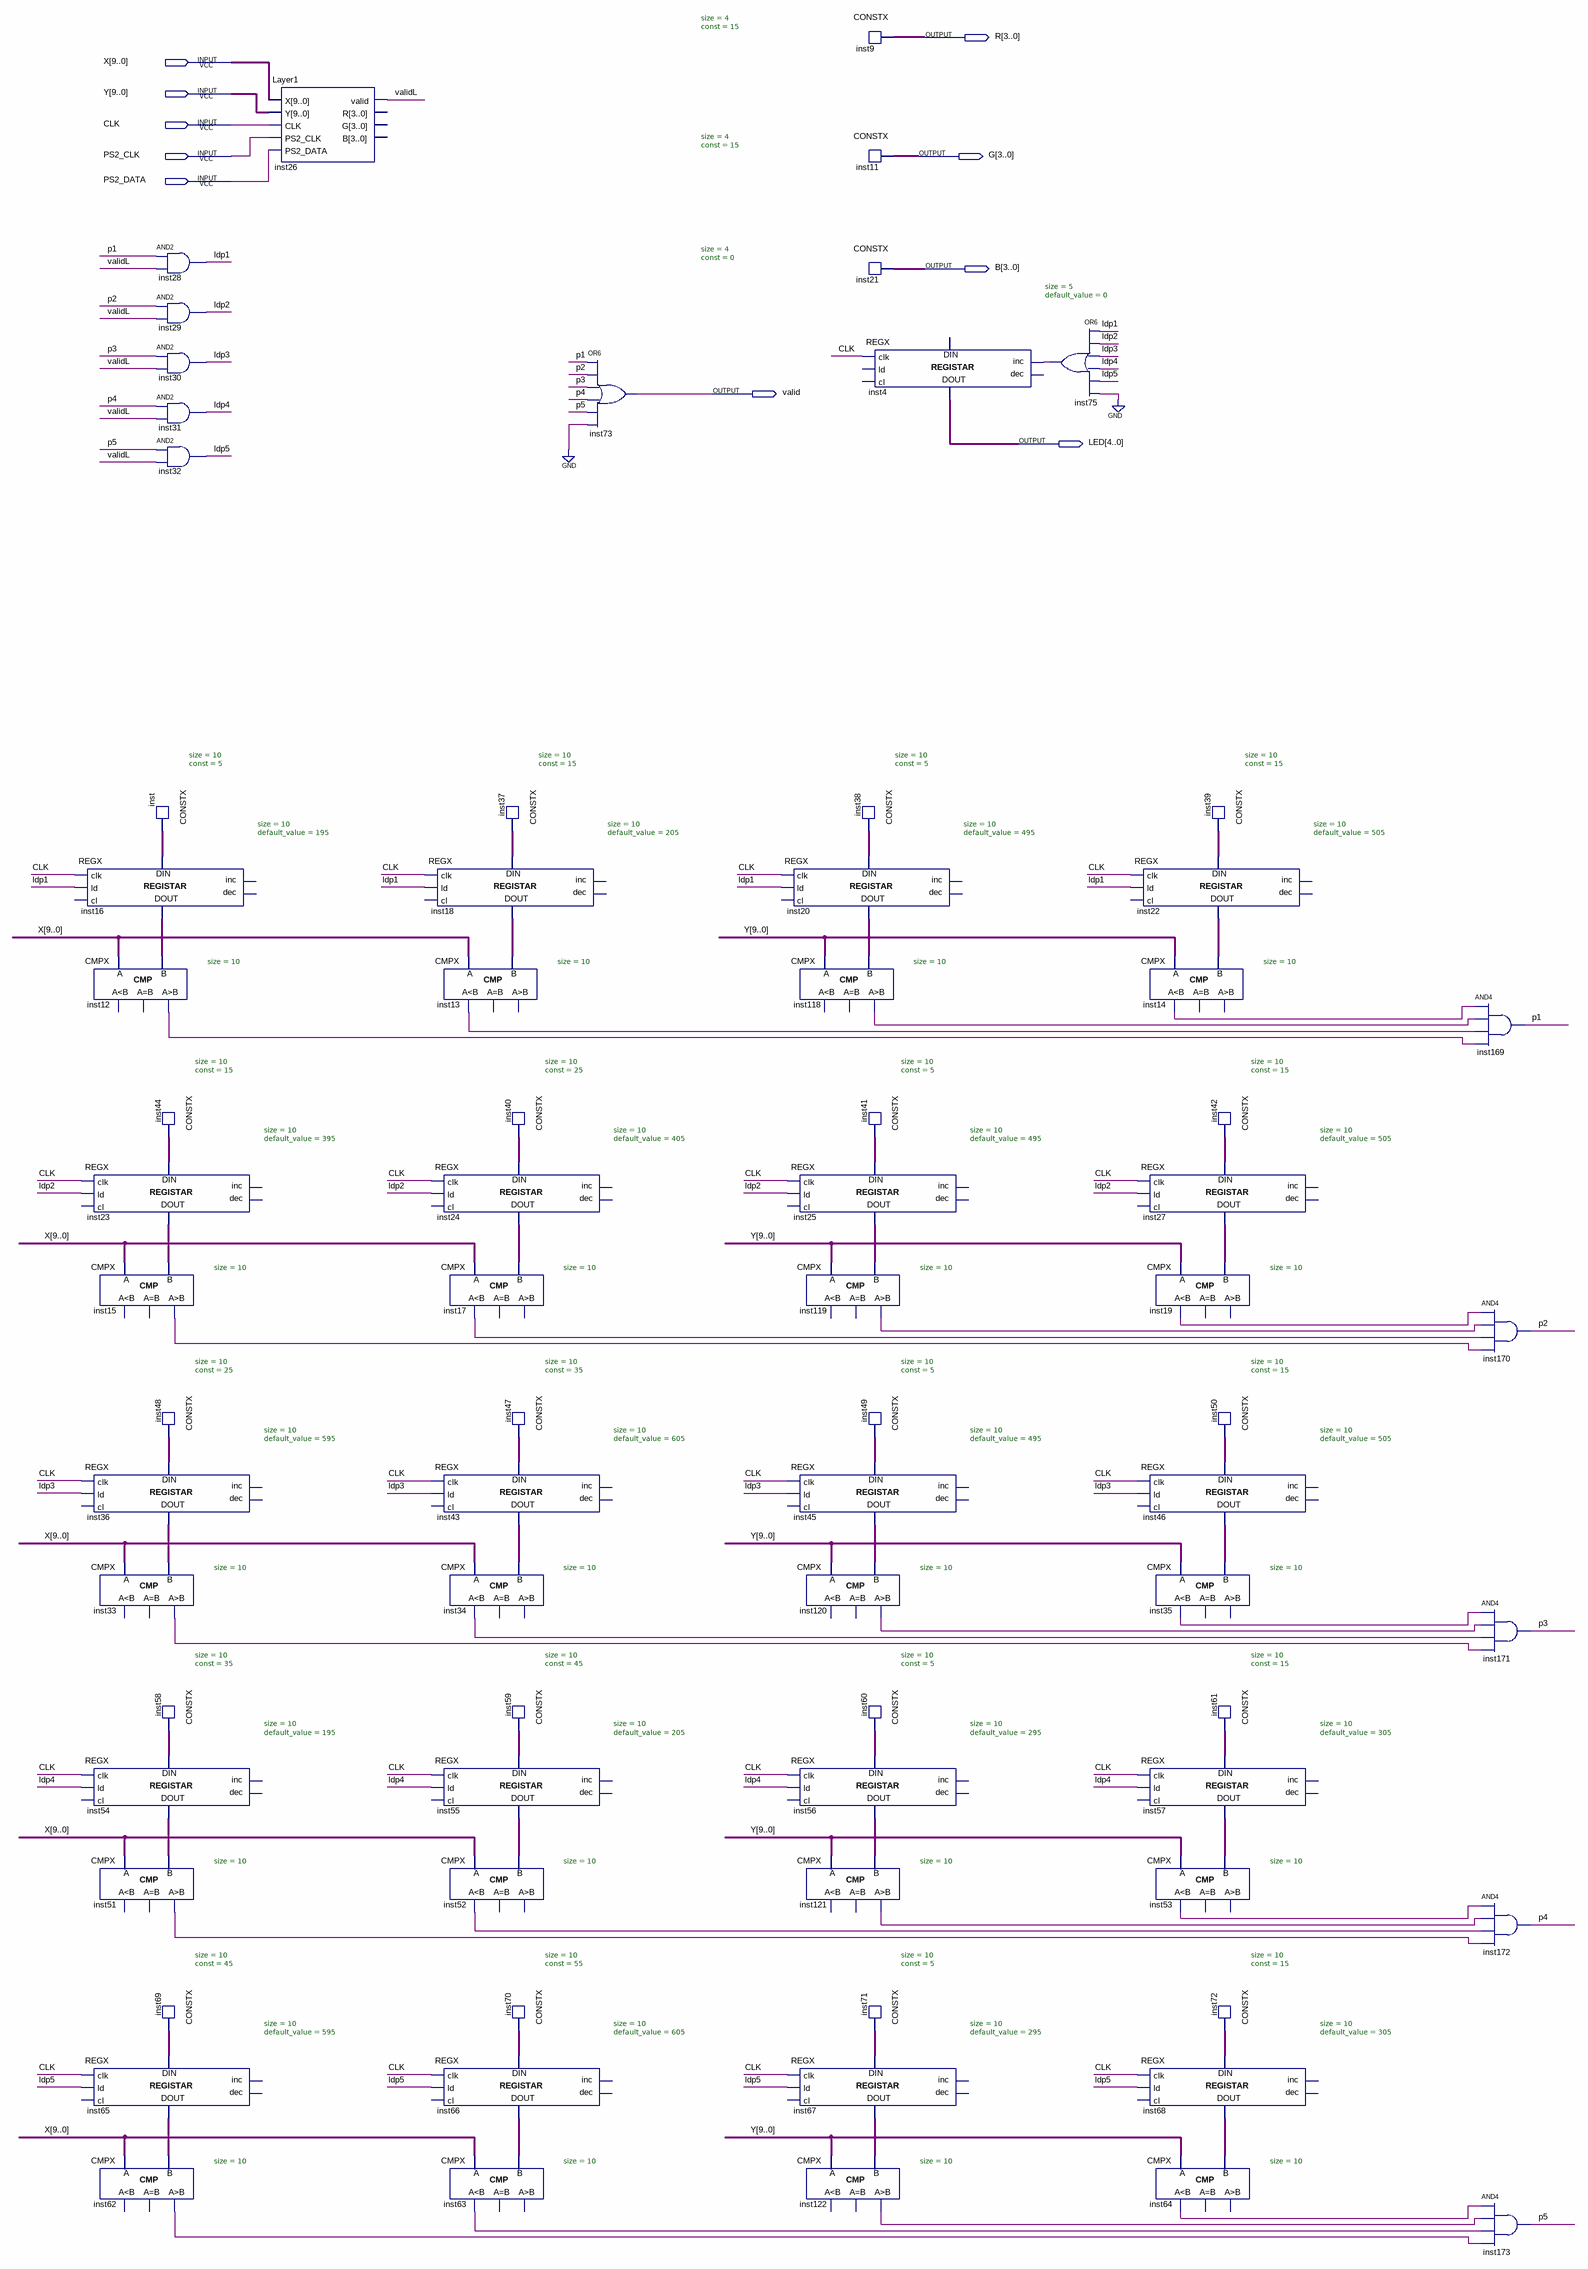
[diagram p0: schematic sheet]
// Quartus schematic Layer2.bdf as structural Verilog: 77 symbols, 10 pins
module Layer2 (
  input  [9:0] X,
  input  [9:0] Y,
  input  CLK,
  input  PS2_CLK,
  input  PS2_DATA,
  output [3:0] R,
  output [3:0] G,
  output [3:0] B,
  output valid,
  output [4:0] LED
);

  wire inst12_gr, inst13_ls, inst14_ls, inst15_gr, inst17_ls, inst19_ls, inst33_gr, inst34_ls, inst35_ls,
       inst51_gr, inst52_ls, inst53_ls, inst62_gr, inst63_ls, inst64_ls, inst75_out, inst118_gr, inst119_gr,
       inst120_gr, inst121_gr, inst122_gr, ldp1, ldp2, ldp3, ldp4, ldp5, p1, p2, p3, p4, p5, validL;
  wire [9:0] inst16_data_out, inst18_data_out, inst20_data_out, inst22_data_out, inst23_data_out,
       inst24_data_out, inst25_data_out, inst27_data_out, inst36_data_out, inst37_data, inst38_data,
       inst39_data, inst40_data, inst41_data, inst42_data, inst43_data_out, inst44_data, inst45_data_out,
       inst46_data_out, inst47_data, inst48_data, inst49_data, inst50_data, inst54_data_out, inst55_data_out,
       inst56_data_out, inst57_data_out, inst58_data, inst59_data, inst60_data, inst61_data, inst65_data_out,
       inst66_data_out, inst67_data_out, inst68_data_out, inst69_data, inst70_data, inst71_data, inst72_data,
       inst_data;

  REGX #(.size(10), .default_value(195)) inst16 (
    .clk(CLK), .ld(ldp1), .data_in(inst_data), .data_out(inst16_data_out));  // open: cl, inc, dec
  CMPX #(.size(10)) inst12 (.A(X), .B(inst16_data_out), .gr(inst12_gr));  // open: ls, eq
  REGX #(.size(10), .default_value(395)) inst23 (
    .clk(CLK), .ld(ldp2), .data_in(inst44_data), .data_out(inst23_data_out));  // open: cl, inc, dec
  REGX #(.size(10), .default_value(595)) inst36 (
    .clk(CLK), .ld(ldp3), .data_in(inst48_data), .data_out(inst36_data_out));  // open: cl, inc, dec
  REGX #(.size(10), .default_value(195)) inst54 (
    .clk(CLK), .ld(ldp4), .data_in(inst58_data), .data_out(inst54_data_out));  // open: cl, inc, dec
  REGX #(.size(10), .default_value(595)) inst65 (
    .clk(CLK), .ld(ldp5), .data_in(inst69_data), .data_out(inst65_data_out));  // open: cl, inc, dec
  CMPX #(.size(10)) inst15 (.A(X), .B(inst23_data_out), .gr(inst15_gr));  // open: ls, eq
  CMPX #(.size(10)) inst33 (.A(X), .B(inst36_data_out), .gr(inst33_gr));  // open: ls, eq
  CMPX #(.size(10)) inst51 (.A(X), .B(inst54_data_out), .gr(inst51_gr));  // open: ls, eq
  CMPX #(.size(10)) inst62 (.A(X), .B(inst65_data_out), .gr(inst62_gr));  // open: ls, eq
  and inst28 (ldp1, p1, validL);
  and inst29 (ldp2, p2, validL);
  and inst30 (ldp3, p3, validL);
  and inst31 (ldp4, p4, validL);
  and inst32 (ldp5, p5, validL);
  CONSTX #(.size(10), .\const (5)) inst (.data(inst_data));
  CONSTX #(.size(10), .\const (15)) inst44 (.data(inst44_data));
  CONSTX #(.size(10), .\const (25)) inst48 (.data(inst48_data));
  CONSTX #(.size(10), .\const (35)) inst58 (.data(inst58_data));
  CONSTX #(.size(10), .\const (45)) inst69 (.data(inst69_data));
  Layer1 inst26 (.X(X), .Y(Y), .CLK(CLK), .PS2_CLK(PS2_CLK), .PS2_DATA(PS2_DATA), .valid(validL));  // open: R, G, B
  REGX #(.size(10), .default_value(205)) inst18 (
    .clk(CLK), .ld(ldp1), .data_in(inst37_data), .data_out(inst18_data_out));  // open: cl, inc, dec
  CMPX #(.size(10)) inst13 (.A(X), .B(inst18_data_out), .ls(inst13_ls));  // open: eq, gr
  REGX #(.size(10), .default_value(405)) inst24 (
    .clk(CLK), .ld(ldp2), .data_in(inst40_data), .data_out(inst24_data_out));  // open: cl, inc, dec
  REGX #(.size(10), .default_value(605)) inst43 (
    .clk(CLK), .ld(ldp3), .data_in(inst47_data), .data_out(inst43_data_out));  // open: cl, inc, dec
  REGX #(.size(10), .default_value(205)) inst55 (
    .clk(CLK), .ld(ldp4), .data_in(inst59_data), .data_out(inst55_data_out));  // open: cl, inc, dec
  REGX #(.size(10), .default_value(605)) inst66 (
    .clk(CLK), .ld(ldp5), .data_in(inst70_data), .data_out(inst66_data_out));  // open: cl, inc, dec
  CMPX #(.size(10)) inst17 (.A(X), .B(inst24_data_out), .ls(inst17_ls));  // open: eq, gr
  CMPX #(.size(10)) inst34 (.A(X), .B(inst43_data_out), .ls(inst34_ls));  // open: eq, gr
  CMPX #(.size(10)) inst52 (.A(X), .B(inst55_data_out), .ls(inst52_ls));  // open: eq, gr
  CMPX #(.size(10)) inst63 (.A(X), .B(inst66_data_out), .ls(inst63_ls));  // open: eq, gr
  CONSTX #(.size(10), .\const (15)) inst37 (.data(inst37_data));
  CONSTX #(.size(10), .\const (25)) inst40 (.data(inst40_data));
  CONSTX #(.size(10), .\const (35)) inst47 (.data(inst47_data));
  CONSTX #(.size(10), .\const (45)) inst59 (.data(inst59_data));
  CONSTX #(.size(10), .\const (55)) inst70 (.data(inst70_data));
  or inst73 (valid, p1, p2, p3, p4, p5, 1'b0);
  REGX #(.size(10), .default_value(495)) inst20 (
    .clk(CLK), .ld(ldp1), .data_in(inst38_data), .data_out(inst20_data_out));  // open: cl, inc, dec
  CMPX #(.size(10)) inst118 (.A(Y), .B(inst20_data_out), .gr(inst118_gr));  // open: ls, eq
  REGX #(.size(10), .default_value(495)) inst25 (
    .clk(CLK), .ld(ldp2), .data_in(inst41_data), .data_out(inst25_data_out));  // open: cl, inc, dec
  CMPX #(.size(10)) inst119 (.A(Y), .B(inst25_data_out), .gr(inst119_gr));  // open: ls, eq
  REGX #(.size(10), .default_value(495)) inst45 (
    .clk(CLK), .ld(ldp3), .data_in(inst49_data), .data_out(inst45_data_out));  // open: cl, inc, dec
  CMPX #(.size(10)) inst120 (.A(Y), .B(inst45_data_out), .gr(inst120_gr));  // open: ls, eq
  REGX #(.size(10), .default_value(295)) inst56 (
    .clk(CLK), .ld(ldp4), .data_in(inst60_data), .data_out(inst56_data_out));  // open: cl, inc, dec
  CMPX #(.size(10)) inst121 (.A(Y), .B(inst56_data_out), .gr(inst121_gr));  // open: ls, eq
  REGX #(.size(10), .default_value(295)) inst67 (
    .clk(CLK), .ld(ldp5), .data_in(inst71_data), .data_out(inst67_data_out));  // open: cl, inc, dec
  CMPX #(.size(10)) inst122 (.A(Y), .B(inst67_data_out), .gr(inst122_gr));  // open: ls, eq
  CONSTX #(.size(4), .\const (15)) inst9 (.data(R));
  CONSTX #(.size(4), .\const (15)) inst11 (.data(G));
  CONSTX #(.size(4), .\const (0)) inst21 (.data(B));
  REGX #(.size(5), .default_value(0)) inst4 (
    .clk(CLK), .inc(inst75_out), .data_out(LED));  // open: ld, cl, dec, data_in
  CONSTX #(.size(10), .\const (5)) inst38 (.data(inst38_data));
  CONSTX #(.size(10), .\const (5)) inst41 (.data(inst41_data));
  CONSTX #(.size(10), .\const (5)) inst49 (.data(inst49_data));
  CONSTX #(.size(10), .\const (5)) inst60 (.data(inst60_data));
  CONSTX #(.size(10), .\const (5)) inst71 (.data(inst71_data));
  or inst75 (inst75_out, ldp1, ldp2, ldp3, ldp4, ldp5, 1'b0);
  REGX #(.size(10), .default_value(505)) inst22 (
    .clk(CLK), .ld(ldp1), .data_in(inst39_data), .data_out(inst22_data_out));  // open: cl, inc, dec
  CMPX #(.size(10)) inst14 (.A(Y), .B(inst22_data_out), .ls(inst14_ls));  // open: eq, gr
  REGX #(.size(10), .default_value(505)) inst27 (
    .clk(CLK), .ld(ldp2), .data_in(inst42_data), .data_out(inst27_data_out));  // open: cl, inc, dec
  CMPX #(.size(10)) inst19 (.A(Y), .B(inst27_data_out), .ls(inst19_ls));  // open: eq, gr
  REGX #(.size(10), .default_value(505)) inst46 (
    .clk(CLK), .ld(ldp3), .data_in(inst50_data), .data_out(inst46_data_out));  // open: cl, inc, dec
  CMPX #(.size(10)) inst35 (.A(Y), .B(inst46_data_out), .ls(inst35_ls));  // open: eq, gr
  REGX #(.size(10), .default_value(305)) inst57 (
    .clk(CLK), .ld(ldp4), .data_in(inst61_data), .data_out(inst57_data_out));  // open: cl, inc, dec
  CMPX #(.size(10)) inst53 (.A(Y), .B(inst57_data_out), .ls(inst53_ls));  // open: eq, gr
  REGX #(.size(10), .default_value(305)) inst68 (
    .clk(CLK), .ld(ldp5), .data_in(inst72_data), .data_out(inst68_data_out));  // open: cl, inc, dec
  CMPX #(.size(10)) inst64 (.A(Y), .B(inst68_data_out), .ls(inst64_ls));  // open: eq, gr
  CONSTX #(.size(10), .\const (15)) inst39 (.data(inst39_data));
  CONSTX #(.size(10), .\const (15)) inst42 (.data(inst42_data));
  CONSTX #(.size(10), .\const (15)) inst50 (.data(inst50_data));
  CONSTX #(.size(10), .\const (15)) inst61 (.data(inst61_data));
  CONSTX #(.size(10), .\const (15)) inst72 (.data(inst72_data));
  and inst169 (p1, inst14_ls, inst118_gr, inst13_ls, inst12_gr);
  and inst170 (p2, inst19_ls, inst119_gr, inst17_ls, inst15_gr);
  and inst171 (p3, inst35_ls, inst120_gr, inst34_ls, inst33_gr);
  and inst172 (p4, inst53_ls, inst121_gr, inst52_ls, inst51_gr);
  and inst173 (p5, inst64_ls, inst122_gr, inst63_ls, inst62_gr);
endmodule
